# Altium schematic sheet Coil Switching System.SchDoc
size C
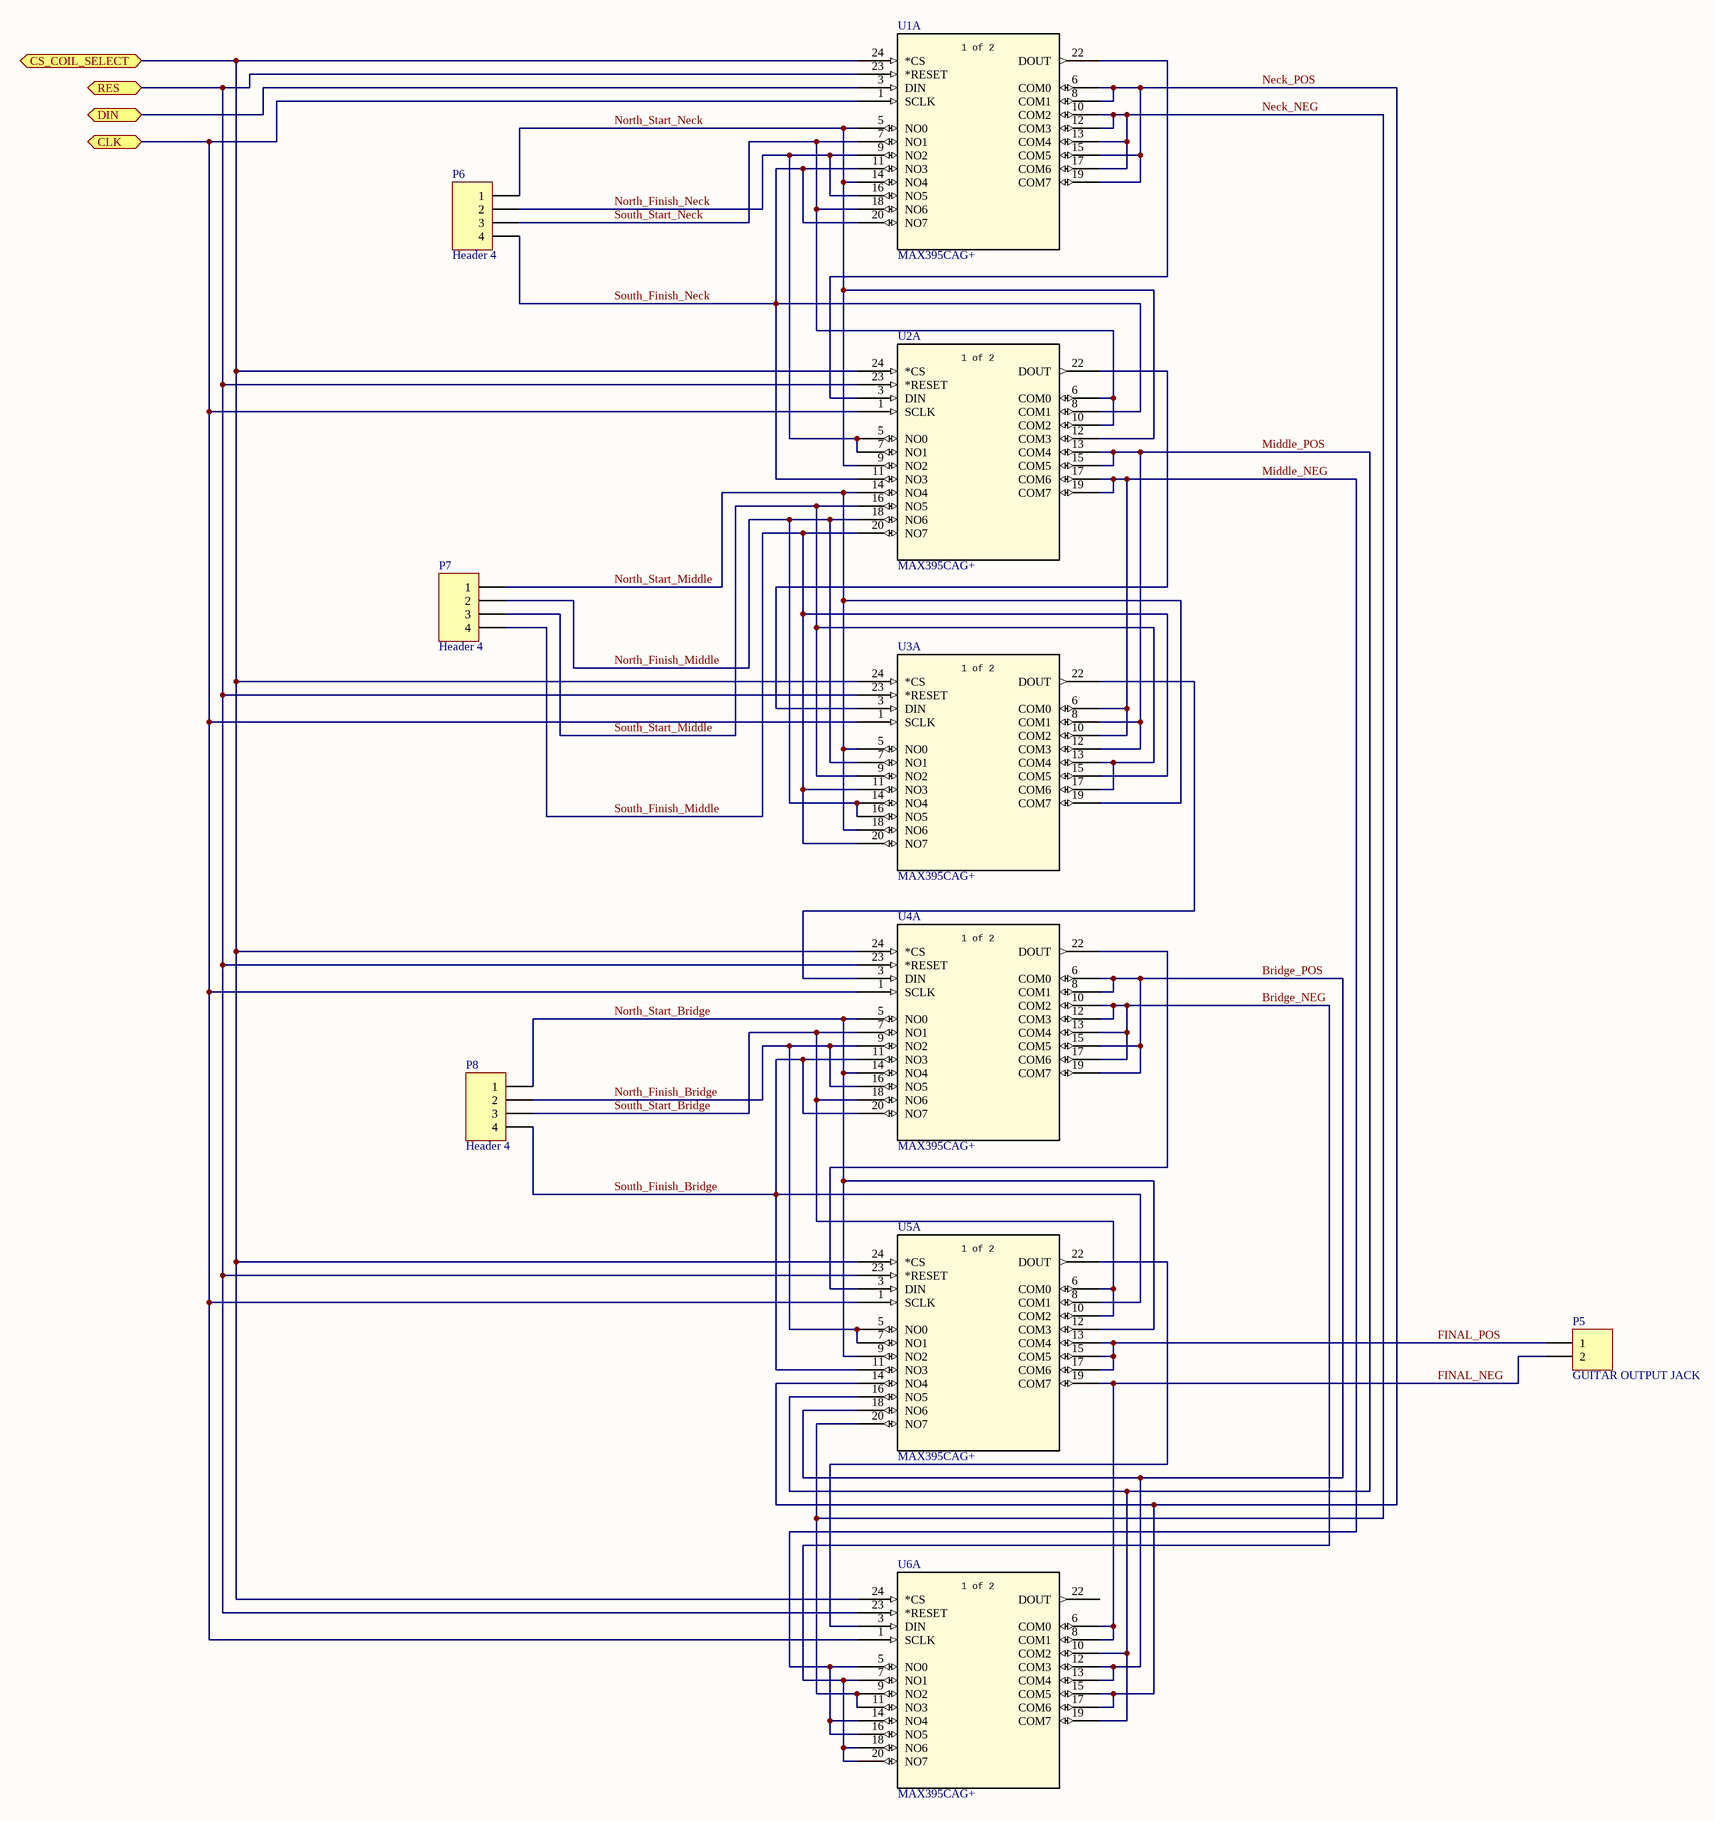
[diagram p0: Coil Switching System.SchDoc]

## Parts
P5  GUITAR OUTPUT JACK  [HDR1X2]
P6  Header 4  [HDR1X4]
P7  Header 4  [HDR1X4]
P8  Header 4  [HDR1X4]
U1  MAX395CAG+  [21-0056C_24_MXM]  (part A of 2)
U2  MAX395CAG+  [21-0056C_24_MXM]  (part A of 2)
U3  MAX395CAG+  [21-0056C_24_MXM]  (part A of 2)
U4  MAX395CAG+  [21-0056C_24_MXM]  (part A of 2)
U5  MAX395CAG+  [21-0056C_24_MXM]  (part A of 2)
U6  MAX395CAG+  [21-0056C_24_MXM]  (part A of 2)

## Ports
CLK, CS_COIL_SELECT, DIN, RES

## Nets
Bridge_NEG: U4.10(COM2) U4.12(COM3) U4.13(COM4) U4.17(COM6) U6.7(NO1) U6.18(NO6) U6.20(NO7)
Bridge_POS: U4.6(COM0) U4.8(COM1) U4.15(COM5) U4.19(COM7) U5.18(NO6) U6.12(COM3) U6.13(COM4)
CLK: U1.1(SCLK) U2.1(SCLK) U3.1(SCLK) U4.1(SCLK) U5.1(SCLK) U6.1(SCLK) ; port CLK
CS_COIL_SELECT: U1.24(*CS) U2.24(*CS) U3.24(*CS) U4.24(*CS) U5.24(*CS) U6.24(*CS) ; port CS_COIL_SELECT
DIN: U1.3(DIN) ; port DIN
FINAL_NEG: P5.2 U5.19(COM7) U6.6(COM0) U6.8(COM1)
FINAL_POS: P5.1 U5.13(COM4) U5.15(COM5) U5.17(COM6)
Middle_NEG: U2.17(COM6) U2.19(COM7) U3.6(COM0) U3.10(COM2) U6.5(NO0) U6.14(NO4) U6.16(NO5)
Middle_POS: U2.13(COM4) U2.15(COM5) U3.8(COM1) U3.12(COM3) U5.16(NO5) U6.10(COM2) U6.19(COM7)
Neck_NEG: U1.10(COM2) U1.12(COM3) U1.13(COM4) U1.17(COM6) U5.20(NO7) U6.9(NO2) U6.11(NO3)
Neck_POS: U1.6(COM0) U1.8(COM1) U1.15(COM5) U1.19(COM7) U5.14(NO4) U6.15(COM5) U6.17(COM6)
North_Finish_Bridge: P8.2 U4.9(NO2) U4.16(NO5) U5.5(NO0) U5.7(NO1)
North_Finish_Middle: P7.2 U2.18(NO6) U3.7(NO1) U3.14(NO4) U3.16(NO5)
North_Finish_Neck: P6.2 U1.9(NO2) U1.16(NO5) U2.5(NO0) U2.7(NO1)
North_Start_Bridge: P8.1 U4.5(NO0) U4.14(NO4) U5.9(NO2) U5.12(COM3)
North_Start_Middle: P7.1 U2.14(NO4) U3.5(NO0) U3.18(NO6) U3.19(COM7)
North_Start_Neck: P6.1 U1.5(NO0) U1.14(NO4) U2.9(NO2) U2.12(COM3)
RES: U1.23(*RESET) U2.23(*RESET) U3.23(*RESET) U4.23(*RESET) U5.23(*RESET) U6.23(*RESET) ; port RES
South_Finish_Bridge: P8.4 U4.11(NO3) U4.20(NO7) U5.8(COM1) U5.11(NO3)
South_Finish_Middle: P7.4 U2.20(NO7) U3.11(NO3) U3.15(COM5) U3.20(NO7)
South_Finish_Neck: P6.4 U1.11(NO3) U1.20(NO7) U2.8(COM1) U2.11(NO3)
South_Start_Bridge: P8.3 U4.7(NO1) U4.18(NO6) U5.6(COM0) U5.10(COM2)
South_Start_Middle: P7.3 U2.16(NO5) U3.9(NO2) U3.13(COM4) U3.17(COM6)
South_Start_Neck: P6.3 U1.7(NO1) U1.18(NO6) U2.6(COM0) U2.10(COM2)
NetU1_22: U1.22(DOUT) U2.3(DIN)
NetU2_22: U2.22(DOUT) U3.3(DIN)
NetU3_22: U3.22(DOUT) U4.3(DIN)
NetU4_22: U4.22(DOUT) U5.3(DIN)
NetU5_22: U5.22(DOUT) U6.3(DIN)

Not connected (* = marked no-connect by the designer): U6 22(DOUT)

## Notes on the sheet
- (in symbol MAX395CAG+, part A) 1 of 2

## Library data of the parts
P5 = Header 2: Header, 2-Pin; LatestRevisionDate: 17-Jul-2002; LatestRevisionNote: Re-released for DXP Platform.; Publisher: Altium Limited
P6-P8 = Header 4: Header, 4-Pin; LatestRevisionDate: 17-Jul-2002; LatestRevisionNote: Re-released for DXP Platform.; Publisher: Altium Limited
U1-U6 = MAX395CAG+: No Description Available; SourceLibrary: Maxim_2014-05-21; Built_By: EMA_UL_Team; Vendor: Maxim Integrated Products; Manufacturer_Part_Number: MAX395CAG+; Copyright: Copyright (C) 2018 Accelerated Designs. All rights reserved; RefDes: RefDes; Type: DEV